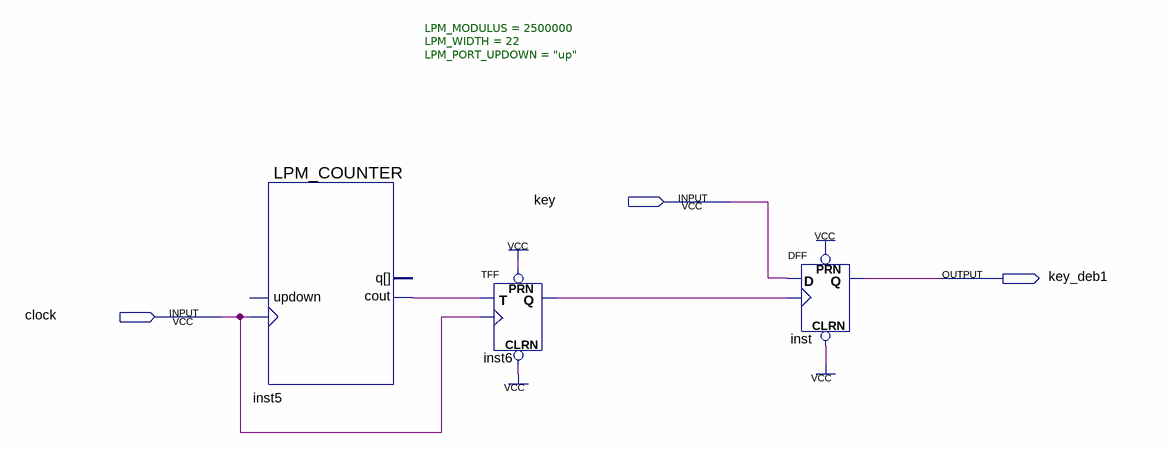
[diagram p0: schematic sheet]
// Quartus schematic key_deb1.bdf as structural Verilog: 3 symbols, 3 pins
module key_deb1 (
  input  key,
  input  clock,
  output key_deb1
);

  wire inst5_cout, inst6_q;

  LPM_COUNTER #(.LPM_MODULUS(2500000), .LPM_WIDTH(22), .LPM_PORT_UPDOWN("up")) inst5 (
    .clock(clock), .cout(inst5_cout));  // open: updown, q
  TFF inst6 (.PRN(1'b1), .CLRN(1'b1), .T(inst5_cout), .CLK(clock), .Q(inst6_q));
  DFF inst (.CLRN(1'b1), .CLK(inst6_q), .D(key), .PRN(1'b1), .Q(key_deb1));
endmodule
